# EAGLE design motor_controller_2_1 (EAGLE 9.6.2)
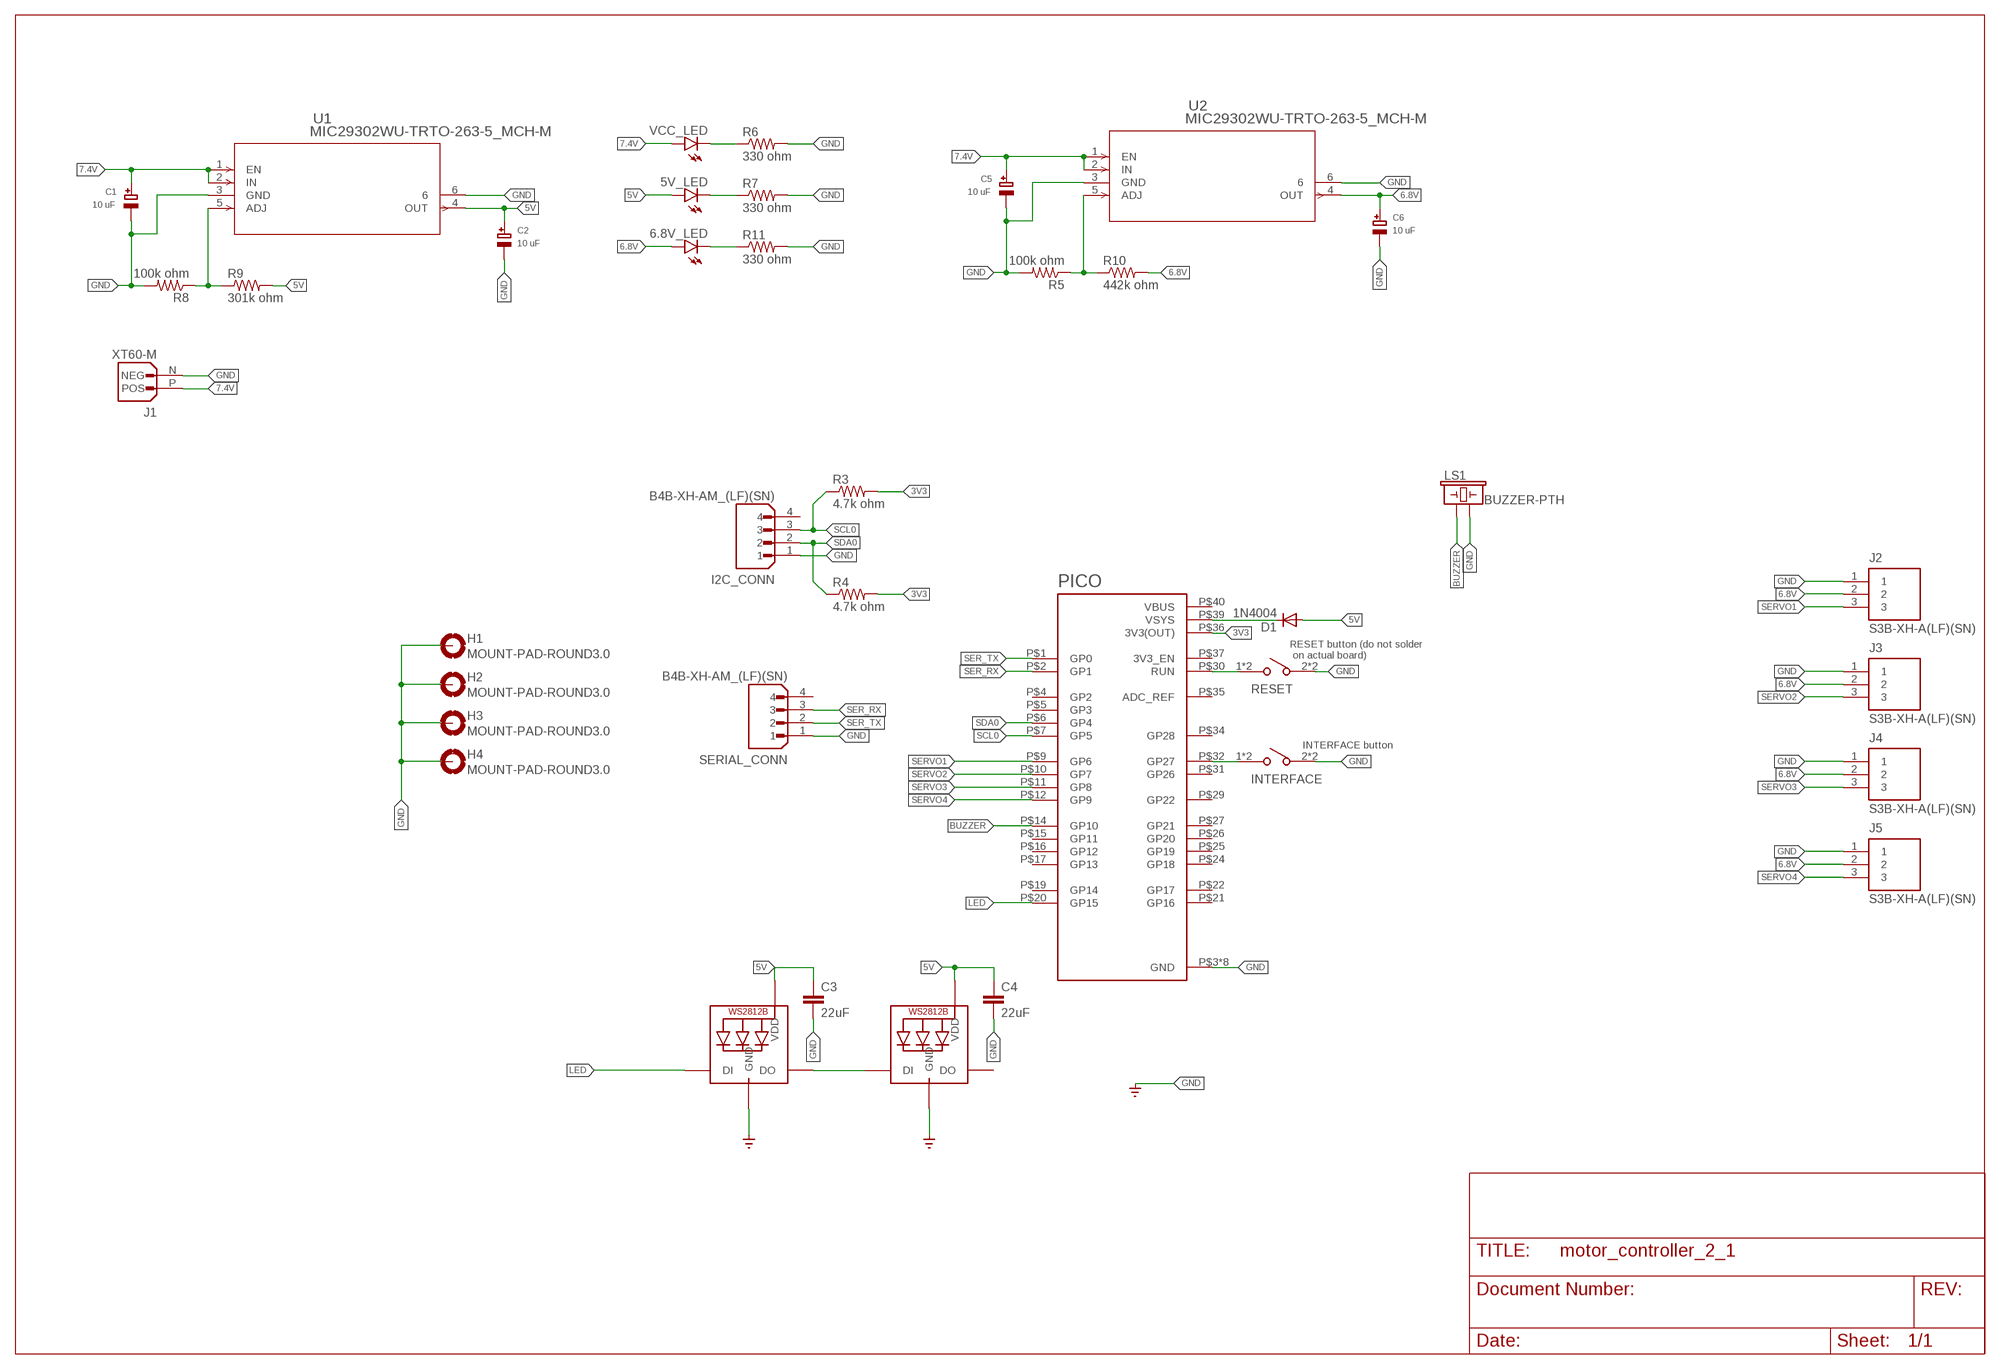
[diagram p0: schematic, sheet 1]

## Parts
5V_LED  LEDCHIPLED_1206  [CHIPLED_1206]
6.8V_LED  LEDCHIPLED_1206  [CHIPLED_1206]
C1  10 uF  CAP_TANTALUMA/3216_WAVE  [EIA3216-18/A-W]
C2  10 uF  CAP_TANTALUMA/3216_WAVE  [EIA3216-18/A-W]
C3  22uF  22UF-0805-16V-20%  [0805]
C4  22uF  22UF-0805-16V-20%  [0805]
C5  10 uF  CAP_TANTALUMA/3216_WAVE  [EIA3216-18/A-W]
C6  10 uF  CAP_TANTALUMA/3216_WAVE  [EIA3216-18/A-W]
D1  1N4004  [DO41-10]
H1  MOUNT-PAD-ROUND3.0  [3,0-PAD]
H2  MOUNT-PAD-ROUND3.0  [3,0-PAD]
H3  MOUNT-PAD-ROUND3.0  [3,0-PAD]
H4  MOUNT-PAD-ROUND3.0  [3,0-PAD]
I2C_CONN  B4B-XH-AM_(LF)(SN)  [JST_B4B-XH-AM_(LF)(SN)]
INTERFACE  TS04-66-95-BK-100-SMT  [SW_TS04-66-95-BK-100-SMT]
J1  XT60-M  [AMASS_XT60-M]
J2  S3B-XH-A(LF)(SN)  [JST_S3B-XH-A(LF)(SN)]
J3  S3B-XH-A(LF)(SN)  [JST_S3B-XH-A(LF)(SN)]
J4  S3B-XH-A(LF)(SN)  [JST_S3B-XH-A(LF)(SN)]
J5  S3B-XH-A(LF)(SN)  [JST_S3B-XH-A(LF)(SN)]
LED1  WS2812B3535  [LED3535]
LED2  WS2812B3535  [LED3535]
LS1  BUZZER-PTH  [BUZZER-12MM]
PICO  RASPBERRY_PICO-NO_DEBUG  [PICO-PKG-NO_DEBUG]
R3  4.7k ohm  R-US_R0805  [R0805]
R4  4.7k ohm  R-US_R0805  [R0805]
R5  100k ohm  R-US_R0805  [R0805]
R6  330 ohm  R-US_R0805  [R0805]
R7  330 ohm  R-US_R0805  [R0805]
R8  100k ohm  R-US_R0805  [R0805]
R9  301k ohm  R-US_R0805  [R0805]
R10  442k ohm  R-US_R0805  [R0805]
R11  330 ohm  R-US_R0805  [R0805]
RESET  TS04-66-95-BK-100-SMT  [SW_TS04-66-95-BK-100-SMT]
SERIAL_CONN  B4B-XH-AM_(LF)(SN)  [JST_B4B-XH-AM_(LF)(SN)]
U1  MIC29302WU-TRTO-263-5_MCH-M  [TO-263-5_MCH-M]
U2  MIC29302WU-TRTO-263-5_MCH-M  [TO-263-5_MCH-M]
VCC_LED  LEDCHIPLED_1206  [CHIPLED_1206]

## Nets
3V3: PICO.P$36(3V3(OUT)) R3.2 R4.2
5V: 5V_LED.A C2.+ C3.1 C4.1 D1.A LED1.2(VDD) LED2.2(VDD) R9.2 U1.4(OUT)
6.8V: 6.8V_LED.A C6.+ J2.2 J3.2 J4.2 J5.2 R10.2 U2.4(OUT)
7.4V: C1.+ C5.+ J1.P(POS) U1.1(EN) U1.2(IN) U2.1(EN) U2.2(IN) VCC_LED.A
BUZZER: LS1.+ PICO.P$14(GP10)
GND: C1.- C2.- C3.2 C4.2 C5.- C6.- H1.B3,0(MOUNT) H2.B3,0(MOUNT) H3.B3,0(MOUNT) H4.B3,0(MOUNT) I2C_CONN.1 INTERFACE.2 INTERFACE.4 J1.N(NEG) J2.1 J3.1 J4.1 J5.1 LED1.4(GND) LED2.4(GND) LS1.- PICO.P$3(GND) PICO.P$8(GND) PICO.P$13(GND) PICO.P$18(GND) PICO.P$23(GND) PICO.P$28(GND) PICO.P$33(GND) PICO.P$38(GND) R5.2 R6.2 R7.2 R8.2 R11.2 RESET.2 RESET.4 SERIAL_CONN.1 U1.3(GND) U1.6 U2.3(GND) U2.6 ; supply symbol labelled SUPPLY0_GND_
LED: LED1.1(DI) PICO.P$20(GP15)
N$1: D1.C PICO.P$39(VSYS)
N$2: PICO.P$30(RUN) RESET.1 RESET.3
N$3: INTERFACE.1 INTERFACE.3 PICO.P$32(GP27)
N$5: R5.1 R10.1 U2.5(ADJ)
N$7: LED1.3(DO) LED2.1(DI)
N$8: 6.8V_LED.C R11.1
N$9: R6.1 VCC_LED.C
N$10: 5V_LED.C R7.1
N$14: R8.1 R9.1 U1.5(ADJ)
SCL0: I2C_CONN.3 PICO.P$7(GP5) R3.1
SDA0: I2C_CONN.2 PICO.P$6(GP4) R4.1
SER_RX: PICO.P$2(GP1) SERIAL_CONN.3
SER_TX: PICO.P$1(GP0) SERIAL_CONN.2
SERVO1: J2.3 PICO.P$9(GP6)
SERVO2: J3.3 PICO.P$10(GP7)
SERVO3: J4.3 PICO.P$11(GP8)
SERVO4: J5.3 PICO.P$12(GP9)
Unconnected: I2C_CONN.4 LED2.3(DO) PICO.P$4(GP2) PICO.P$5(GP3) PICO.P$15(GP11) PICO.P$16(GP12) PICO.P$17(GP13) PICO.P$19(GP14) PICO.P$21(GP16) PICO.P$22(GP17) PICO.P$24(GP18) PICO.P$25(GP19) PICO.P$26(GP20) PICO.P$27(GP21) PICO.P$29(GP22) PICO.P$31(GP26) PICO.P$34(GP28) PICO.P$35(ADC_REF) PICO.P$37(3V3_EN) SERIAL_CONN.4

## Notes on the sheet
- RESET button (do not solder
   on actual board)
- INTERFACE button

## Power pins joined to a net without a drawn wire
VBUS: PICO.P$40(VBUS)

## Library data of the parts
5V_LED 6.8V_LED VCC_LED = led:LED: LED OSRAM: - CHIPLED LG R971, LG N971, LY N971, LG Q971, LY Q971, LO R971, LY R971 LH N974, LH R974 LS Q976, LO Q976, LY Q976 LO Q996 - Hyper CHIPLED LW Q18S LB Q993, LB Q99A, LB R99A - SideLED LS A670, LO A670, LY A670, LG A670, LP A670 LB A673, LV A673, LT A673, LW A673 LH A674 LY A675 LS A676, LA A676, LO A676, LY A676, LW A676 LS A679, LY A679, LG A679 - Hyper Micro SIDELED® LS Y876, LA Y876, LO Y876, LY Y876 LT Y87S - SmartLED LW L88C, LW L88S LB L89C, LB L89S, LG L890 LS L89K, LO L89K, LY L89K LS L896, LA L896, LO L896, LY L896 - TOPLED LS T670, LO T670, LY T670, LG T670, LP T670 LSG T670, LSP T670, LSY T670, LOP T670, LYG T670 LG T671, LOG T671, LSG T671 LB T673, LV T673, LT T673, LW T673 LH T674 LS T676, LA T676, LO T676, LY T676, LB T676, LH T676, LSB T676, LW T676 LB T67C, LV T67C, LT T67C, LS T67K, LO T67K, LY T67K, LW E67C LS E67B, LA E67B, LO E67B, LY E67B, LB E67C, LV E67C, LT E67C LW T67C LS T679, LY T679, LG T679 LS T770, LO T770, LY T770, LG T770, LP T770 LB T773, LV T773, LT T773, LW T773 LH T774 LS E675, LA E675, LY E675, LS T675 LS T776, LA T776, LO T776, LY T776, LB T776 LHGB T686 LT T68C, LB T68C - Hyper Mini TOPLED® LB M676 - Mini TOPLED Santana® LG M470 LS M47K, LO M47K, LY M47K Source: http://www.osram.convergy.de LUXEON: - LUMILED® LXK2-PW12-R00, LXK2-PW12-S00, LXK2-PW14-U00, LXK2-PW14-V00 LXK2-PM12-R00, LXK2-PM12-S00, LXK2-PM14-U00 LXK2-PE12-Q00, LXK2-PE12-R00, LXK2-PE12-S00, LXK2-PE14-T00, LXK2-PE14-U00 LXK2-PB12-K00, LXK2-PB12-L00, LXK2-PB12-M00, LXK2-PB14-N00, LXK2-PB14-P00, LXK2-PB14-Q00 LXK2-PR12-L00, LXK2-PR12-M00, LXK2-PR14-Q00, LXK2-PR14-R00 LXK2-PD12-Q00, LXK2-PD12-R00, LXK2-PD12-S00 LXK2-PH12-R00, LXK2-PH12-S00 LXK2-PL12-P00, LXK2-PL12-Q00, LXK2-PL12-R00 Source: www.luxeon.com KINGBRIGHT: KA-3528ASYC Source: www.kingbright.com
C1 C2 C5 C6 = microbuilder:CAP_TANTALUM: Tantalum Capacitors Wave footprints have larger pads and are meant to be used for hand soldering. Reflow footprints are optimised for solder paste and a reflow oven. EIA3216-18/A-[R/W] - Size A / 3216-18 / 1206 footprint 4.7µF 25V 10% Tantalum Capacitor 10µF 16V 10% Tantalum Capacitor [Digikey: 495-2236-2-ND] EIA3528-21/B-[R/W] - Size B / 3528-21 47µF 10V 10% Tantalum Capactior [Digikey: 495-2216-1-ND] EIA6032-28/C-[R/W] - Size C / 6032-28 10µF 35V 20% Tantalum Capacitor [Digikey: 495-2285-1-ND] 100µF 16V 10% Tantalum Capactior [Digikey: 399-5214-1-ND]
C3 C4 = SparkFun-Capacitors:22UF: 22µF ceramic capacitors A capacitor is a passive two-terminal electrical component used to store electrical energy temporarily in an electric field.; PROD_ID: CAP-14260
D1 = adafruit:1N4004: DIODE General purpose 1N400x type rectifier (With bigger pads) http://www.ladyada.net/library/pcb/eaglelibrary.html
H1-H4 = holes:MOUNT-PAD-ROUND: MOUNTING PAD, round
I2C_CONN SERIAL_CONN = B4B-XH-AM__LF__SN_:B4B-XH-AM_(LF)(SN): Check availability <https://pricing.snapeda.com/parts/B4B-XH-AM%20%28LF%29%28SN%29/JST%20Corporation/view-part?ref=eda>; AVAILABILITY: In Stock; CHECK_PRICES: https://www.snapeda.com/parts/B4B-XH-AM%20(LF)(SN)/JST/view-part/?ref=eda; DESCRIPTION: Conn Shrouded Header HDR 4 POS 2.5mm Solder ST Top Entry Thru-Hole Box; MF: JST Corporation; MP: B4B-XH-AM (LF)(SN); PACKAGE: None; PRICE: None; SNAPEDA_LINK: https://www.snapeda.com/parts/B4B-XH-AM%20(LF)(SN)/JST/view-part/?ref=snap
INTERFACE RESET = TS04-66-95-BK-100-SMT:TS04-66-95-BK-100-SMT: Check availability <https://pricing.snapeda.com/parts/TS04-66-95-BK-100-SMT/CUI%20Devices/view-part?ref=eda>; AVAILABILITY: In Stock; CHECK_PRICES: https://www.snapeda.com/parts/TS04-66-95-BK-100-SMT/CUI+Devices/view-part/?ref=eda; CUI_PURCHASE_URL: https://www.cuidevices.com/product/switches/tactile-switches/ts04-66-95-bk-100-smt?utm_source=snapeda.com&utm_medium=referral&utm_campaign=snapedaBOM; DESCRIPTION: 6 x 6 mm, 9.5 mm Actuator Height, 100 gf, Black, Surface Mount, SPST, Tactile Switch; MF: CUI Devices; MP: TS04-66-95-BK-100-SMT; PACKAGE: None; PRICE: None; SNAPEDA_LINK: https://www.snapeda.com/parts/TS04-66-95-BK-100-SMT/CUI+Devices/view-part/?ref=snap
J1 = XT60-M:XT60-M: Check availability <https://pricing.snapeda.com/parts/XT60-M/AMASS/view-part?ref=eda>; AVAILABILITY: Not in stock; DESCRIPTION: Plug; DC supply; XT60; male; PIN: 2; for cable; soldered; 30A; 500V; MF: AMASS; MP: XT60-M; PACKAGE: Package; PRICE: None
J2-J5 = S3B-XH-A_LF__SN_:S3B-XH-A(LF)(SN): Connector Header Through Hole, Right Angle 3 position 0.098" (2.50mm) Check availability <https://pricing.snapeda.com/parts/S3B-XH-A%28LF%29%28SN%29/JST%20Sales/view-part?ref=eda>; AVAILABILITY: In Stock; CHECK_PRICES: https://www.snapeda.com/parts/S3B-XH-A(LF)(SN)/JST+Sales+America+Inc./view-part/?ref=eda; DESCRIPTION: Connector Header Through Hole, Right Angle 3 position 0.098 (2.50mm); MF: JST Sales; MP: S3B-XH-A(LF)(SN); PACKAGE: Custom Package JST Sales; PRICE: None; SNAPEDA_LINK: https://www.snapeda.com/parts/S3B-XH-A(LF)(SN)/JST+Sales+America+Inc./view-part/?ref=snap
LED1 LED2 = WS2812B:WS2812B: Check availability <https://pricing.snapeda.com/parts/WS2812B/Worldsemi/view-part?ref=eda>; AVAILABILITY: Not in stock; CHECK_PRICES: https://www.snapeda.com/parts/WS2812B/Worldsemi/view-part/?ref=eda; DESCRIPTION: Intelligent control LED integrated light source; MF: Worldsemi; MP: WS2812B; PACKAGE: None; PRICE: None; SNAPEDA_LINK: https://www.snapeda.com/parts/WS2812B/Worldsemi/view-part/?ref=snap
LS1 = SparkFun-Electromechanical:BUZZER: Buzzer Small round buzzers that operate around the audible 2kHz range. You can use these as speakers to create simple music or user interfaces. Variant Overview: PTH - Mini Speaker - PC Mount 12mm 2.048kHz <https://www.sparkfun.com/products/7950> PTH_KIT - Mini Speaker - PC Mount 12mm 2.048kHz <https://www.sparkfun.com/products/7950> KIT simplifies soldering by adding stop mask to one side of the pads. PTH_NO_SILK - Mini Speaker - PC Mount 12mm 2.048kHz <https://www.sparkfun.com/products/7950> No silkscreen indicator of buzzer outline. PTH_KIT_NO_SILK - Mini Speaker - PC Mount 12mm 2.048kHz <https://www.sparkfun.com/products/7950> KIT package w/o silkscreen SMD - Buzzer Audio Magnetic (CCV-084B16) SMD buzzer used on, e.g. the LilyPad Buzzer <https://www.sparkfun.com/products/8463> and RFID USB Reader <https://www.sparkfun.com/products/9963>. SMD_KIT - Buzzer Audio Magnetic (CCV-084B16) SMD Buzzer with elongated pins to make soldering easier. Used on the SparkFun Simon Says - Surface Mount Soldering Kit <https://www.sparkfun.com/products/10935>. SMD-SQUARE - Buzzer Audio Magnetic (COMP-15701) SMT square buzzer with one chamfered corner.; PROD_ID: COMP-08253; SF_SKU: COM-07950
PICO = RpiPico:RASPBERRY_PICO-NO_DEBUG
R3-R11 = rcl:R-US_: RESISTOR, American symbol; SPICEPREFIX: R
U1 U2 = MIC29302WU:MIC29302WU-TR; COPYRIGHT: Copyright (C) 2024 Ultra Librarian. All rights reserved.; MANUFACTURER_PART_NUMBER: MIC29302WU-TR; MFR_NAME: Microchip

## Board
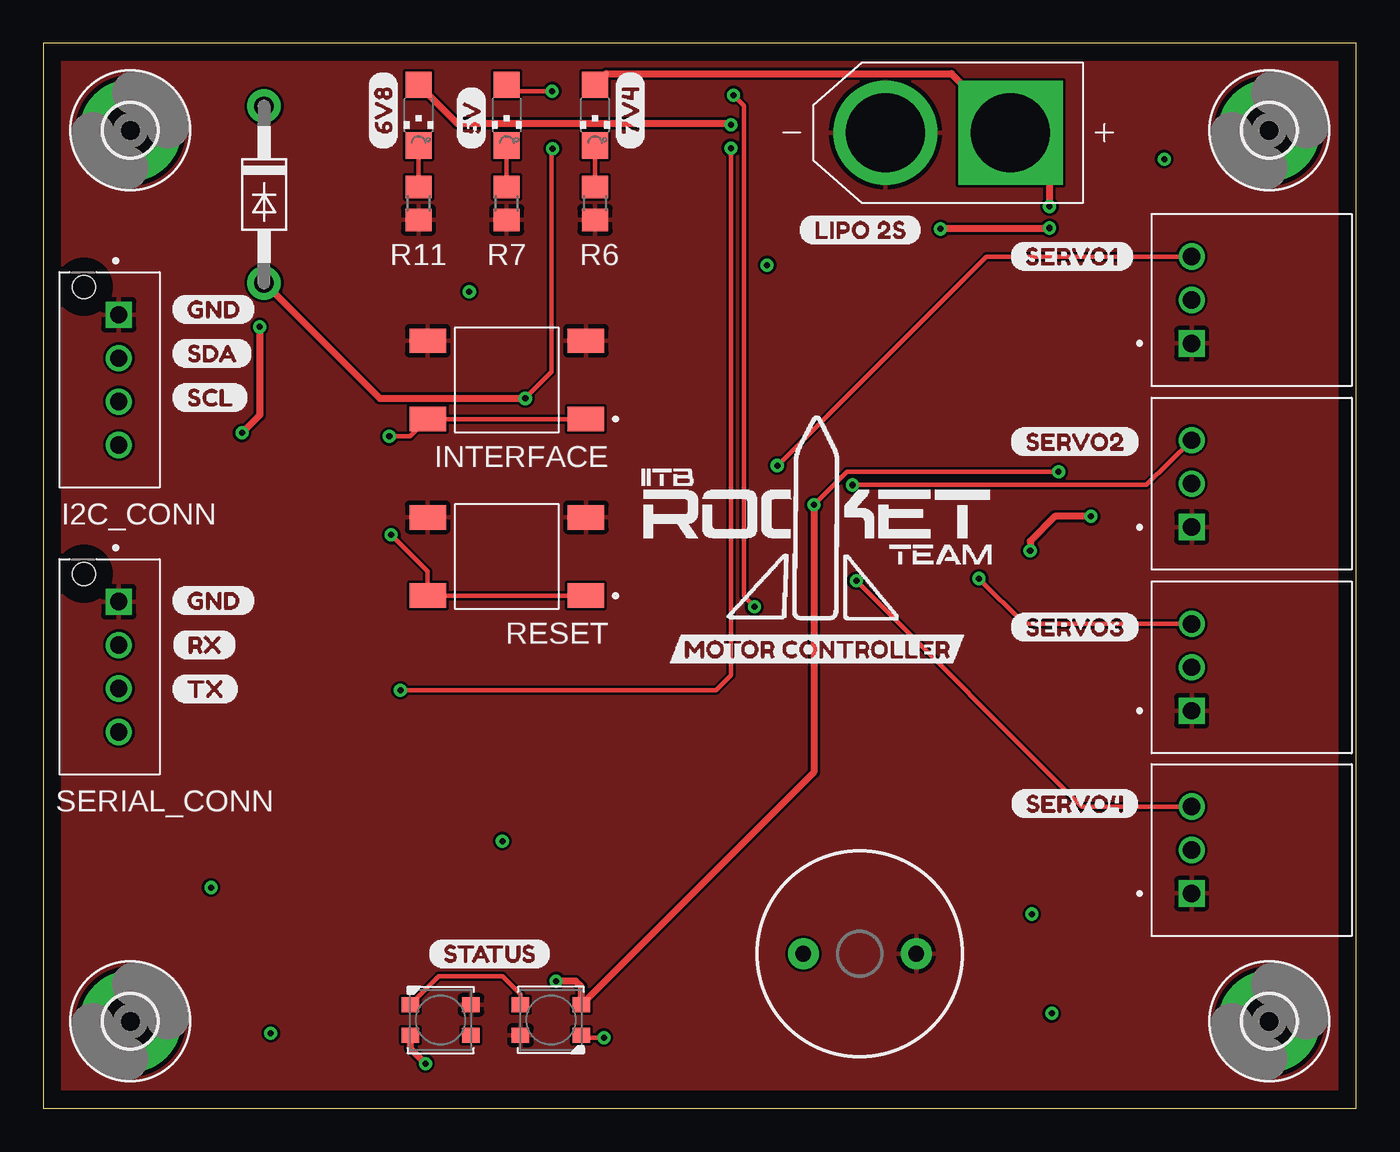
[diagram p1: board, top side]
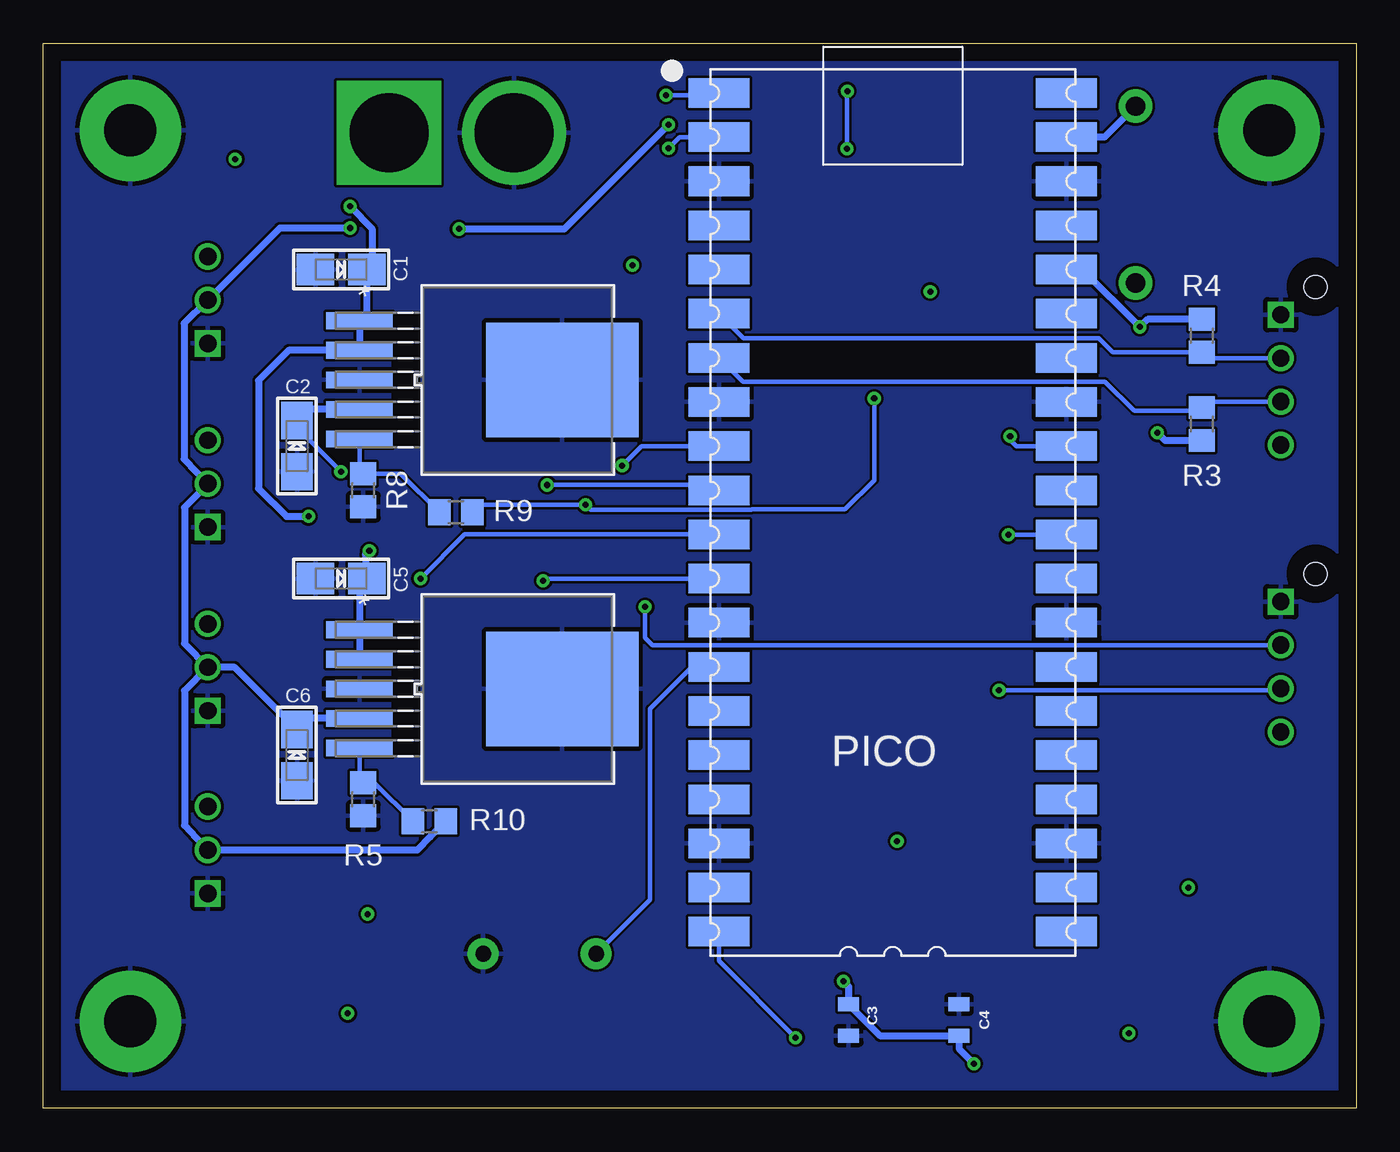
[diagram p2: board, bottom side, seen from below]

Size 75.56 x 61.27 mm. Coordinates in mm from the lower left corner, seen from the top.
Outline: 0,0 75.56,0 75.56,61.27 0,61.27 0,0
Copper layers (1*16): Top 0.035mm / dielectric 1.5mm / Bottom 0.035mm
Design rules "default": minimum track width 6mil, minimum drill 0.35mm, track to track 6mil, track to pad 6mil, pad to pad 6mil, via to via 6mil, smd to smd 6mil, copper to edge 40mil, drill to drill 6mil, minimum pad ring 10mil, minimum via ring 8mil, stop-mask expansion 4mil, vias tented up to drill 0mil, thermal gap 10mil

### Footprints (pad centres in the part's own frame; a part is rotated, then mirrored left to right if it is on the bottom)
CHIPLED_1206 = smd 1.5 x 1.5: A 0,-1.75; C 0,1.75
EIA3216-18/A-W = smd 2.15 x 1.8: + 1.475,0; - -1.475,0
0805 = smd 0.8 x 1.2: 1 -0.9,0; 2 0.9,0
DO41-10 = drill 1.118 pad 1.93: A 5.08,0; C -5.08,0
3,0-PAD = drill 3 pad 5.842: B3,0 0,0
JST_B4B-XH-AM_(LF)(SN) = drill 1 square: 1 3.75,-0.525 | drill 1: 2 1.25,-0.525; 3 -1.25,-0.525; 4 -3.75,-0.525 | hole 1.3: 5.35,1.475
SW_TS04-66-95-BK-100-SMT = smd 2.1 x 1.4: 1 -4.55,2.25; 2 -4.55,-2.25; 3 4.55,2.25; 4 4.55,-2.25
AMASS_XT60-M = drill 4.55 pad 6: N 3.6,0 | drill 4.55 pad 6 square: P -3.6,0
JST_S3B-XH-A(LF)(SN) = drill 1 square: 1 2.5,-3.45 | drill 1: 2 0,-3.45; 3 -2.5,-3.45
LED3535 = smd 1 x 0.85: 1 -1.75,0.875; 2 -1.75,-0.875; 3 1.75,-0.875; 4 1.75,0.875
BUZZER-12MM = drill 0.9 pad 1.778: + 3.25,0; - -3.25,0
PICO-PKG-NO_DEBUG = smd 3.5 x 1.7: P$1 -8.73,25.4; P$2 -8.73,22.86; P$3 -8.73,20.32; P$4 -8.73,17.78; P$5 -8.73,15.24; P$6 -8.73,12.7; P$7 -8.73,10.16; P$8 -8.73,7.62; P$9 -8.73,5.08; P$10 -8.73,2.54; P$11 -8.73,0; P$12 -8.73,-2.54; P$13 -8.73,-5.08; P$14 -8.73,-7.62; P$15 -8.73,-10.16; P$16 -8.73,-12.7; P$17 -8.73,-15.24; P$18 -8.73,-17.78; P$19 -8.73,-20.32; P$20 -8.73,-22.86; P$21 11.27,-22.86; P$22 11.27,-20.32; P$23 11.27,-17.78; P$24 11.27,-15.24; P$25 11.27,-12.7; P$26 11.27,-10.16; P$27 11.27,-7.62; P$28 11.27,-5.08; P$29 11.27,-2.54; P$30 11.27,0; P$31 11.27,2.54; P$32 11.27,5.08; P$33 11.27,7.62; P$34 11.27,10.16; P$35 11.27,12.7; P$36 11.27,15.24; P$37 11.27,17.78; P$38 11.27,20.32; P$39 11.27,22.86; P$40 11.27,25.4
R0805 = smd 1.3 x 1.5: 1 -0.95,0; 2 0.95,0
TO-263-5_MCH-M = smd 0.965 x 3.81: 1 -3.404,-9.106; 2 -1.702,-9.106; 3 0,-9.106; 4 1.702,-9.106; 5 3.404,-9.106 | smd 6.604 x 8.763: 6 0,2.565

### Placement (x,y rotation side)
5V_LED  26.67,57.15 180 top
6.8V_LED  21.59,57.15 180 top
C1  58.42,48.26 0 bottom
C2  60.96,38.1 90 bottom
C3  29.21,5.08 270 bottom
C4  22.86,5.08 90 bottom
C5  58.42,30.48 0 bottom
C6  60.96,20.32 90 bottom
D1  12.7,52.58 270 top
H1  70.56,56.27 0 top
H2  5,56.27 0 top
H3  5,5 0 top
H4  70.56,5 0 top
I2C_CONN  3.81,41.91 90 top
INTERFACE  26.67,41.91 180 top
J1  52.07,56.13 180 top
J2  69.55,46.51 270 top
J3  69.55,35.94 270 top
J4  69.55,25.37 270 top
J5  69.55,14.86 270 top
LED1  29.21,5.08 180 top
LED2  22.86,5.08 0 top
LS1  46.99,8.89 180 top
PICO  27.94,33.02 0 bottom
R3  8.89,39.37 270 bottom
R4  8.89,44.45 90 bottom
R5  57.15,17.78 270 bottom
R6  31.75,52.07 270 top
R7  26.67,52.07 270 top
R8  57.15,35.56 270 bottom
R9  51.82,34.29 0 bottom
R10  53.34,16.51 0 bottom
R11  21.59,52.07 270 top
RESET  26.67,31.75 180 top
SERIAL_CONN  3.81,25.4 90 top
U1  48.26,41.91 270 bottom
U2  48.26,24.13 270 bottom
U$1  [SERVO10]  55.63,49.02 0 top
U$2  [SERVO20]  55.63,38.35 0 top
U$3  [SERVO30]  55.63,27.69 0 top
U$4  [SERVO40]  55.63,17.53 0 top
U$5  [SDA0]  7.37,43.43 0 top
U$6  [SCL0]  7.37,40.89 0 top
U$7  [GND0]  7.37,45.97 0 top
U$8  [GND0]  7.37,29.21 0 top
U$9  [RX0]  7.37,26.67 0 top
U$10  [TX0]  7.37,24.13 0 top
U$11  [LIPO_2S0]  43.43,50.55 0 top
U$12  [5V0]  24.64,55.12 90 top
U$13  [7V40]  33.78,55.12 90 top
U$14  [6V80]  19.56,55.12 90 top
U$15  [STATUS0]  22.1,8.89 0 top
U$16  [MOTOR_CONTROLLER0]  35.94,26.42 0 top
VCC_LED  31.75,57.15 180 top

### Tracks (layer width: path | path; a pad name or v marks a point on that pad's centre or on a via)
3V3  (via drill 0.35)
  Top 0.406: v12.45,44.96 12.45,39.88 v11.43,38.86
  Bottom 0.406: R4.2 12,45.4 v12.45,44.96 15.75,48.26 PICO.P$36 | R3.2 10.99,38.42 v11.43,38.86
5V  (via drill 0.35)
  Top 0.254: v58.43,36.63 46.25,36.63 v44.35,34.72 | v27.74,40.84 29.26,42.37 29.26,55.17 v29.31,55.22 | v29.29,58.52 27.05,58.52 5V_LED.A
  Top 0.406: v29.52,7.31 30.63,7.31 30.96,6.99 LED1.2 44.35,19.34 v44.35,34.72 | LED2.2 21.11,3.45 v22,2.57 | D1.A 19.36,40.84 v27.74,40.84
  Bottom 0.254: C2.+ 60.96,39.16 v58.43,36.63 | R9.2 50.43,34.72 v44.35,34.72 44.06,34.43 34.8,34.43 34.77,34.47 29.41,34.47 27.74,36.14 v27.74,40.84 | v29.31,55.22 29.31,58.5 v29.29,58.52
  Bottom 0.406: U1.4 60.33,40.21 C2.+ | v22,2.57 22.86,3.43 C4.1 27.41,4.18 C3.1 29.21,7.01 v29.52,7.31
6.8V  (via drill 0.35)
  Top 0.406: v57.91,50.65 57.91,50.6 v51.64,50.6 | 6.8V_LED.A 23.82,56.67 39.5,56.67 v39.57,56.59
  Bottom 0.406: U2.4 60.33,22.43 C6.+ 64.54,25.38 J4.2 | v39.57,56.59 45.57,50.6 v51.64,50.6 | v57.91,50.65 61.95,50.65 J2.2 66.11,46.51 67.46,45.16 67.46,37.35 J3.2 66.06,35.94 67.43,34.57 67.43,26.74 J4.2 | J4.2 67.43,24.03 67.43,16.27 J5.2 54.04,14.86 53.28,15.61 53.28,15.62 R10.2
7.4V  (via drill 0.35)
  Top 0.406: VCC_LED.A 32.39,59.54 52.27,59.54 J1.P 57.91,53.89 v57.91,51.89 | v60.3,34.06 58.22,34.06 56.79,32.64 v56.79,32.08
  Bottom 0.406: C5.+ 57.02,30.4 | 57.02,30.4 57.37,30.06 U2.1 U2.2 | v57.91,51.89 56.64,50.62 56.64,48.56 C1.+ 56.95,45.73 U1.1 U1.2 61.44,43.61 63.17,41.88 63.17,35.66 61.57,34.06 v60.3,34.06 | v56.79,32.08 57.02,31.85 57.02,30.4
BUZZER
  Bottom 0.254: LS1.+ 40.64,11.99 40.64,22.99 38.23,25.4 PICO.P$14
GND
  pour Bottom: -0.08,61.21 -0.08,-0.08 75.44,-0.08 75.44,61.21
  pour Top: -0.2,61.29 -0.2,-0.05 75.46,-0.05 75.46,61.29
LED  (via drill 0.35)
  Top 0.254: v32.26,4.06 31.1,4.06 LED1.1
  Bottom 0.254: PICO.P$20 36.67,8.48 v32.26,4.06
N$1
  Bottom 0.406: D1.C 14.48,55.88 PICO.P$39
N$2  (via drill 0.35)
  Top 0.254: RESET.1 RESET.3 22.12,30.89 v20.02,32.99
  Bottom 0.254: v20.02,32.99 16.7,32.99 PICO.P$30
N$3  (via drill 0.35)
  Top 0.254: v19.91,38.66 21.12,38.66 INTERFACE.3 INTERFACE.1
  Bottom 0.254: PICO.P$32 19.56,38.1 19.91,38.46 v19.91,38.66
N$4  (via drill 0.35)
  other vias: 9.65,12.7
N$5
  Bottom 0.254: R10.1 56.51,18.73 R5.1 57.37,18.95 U2.5
N$6  (via drill 0.35)
  other vias: 26.42,15.37
N$7
  Top 0.254: LED2.1 22.75,7.59 26.42,7.59 27.46,6.55 LED1.3
N$8
  Top 0.254: 6.8V_LED.C R11.1
N$9
  Top 0.254: VCC_LED.C R6.1
N$10
  Top 0.254: 5V_LED.C R7.1
N$11  (via drill 0.35)
  other vias: 58.04,5.46
N$12  (via drill 0.35)
  other vias: 56.9,11.18
N$13  (via drill 0.35)
  other vias: 41.66,48.51
N$14
  Bottom 0.254: R9.1 54.99,36.51 57.02,36.51 | 57.02,36.51 R8.1 | U1.5 57.37,36.85 57.02,36.51
N$15  (via drill 0.35)
  other vias: 64.52,54.61
N$16  (via drill 0.35)
  other vias: 24.51,46.99
N$17  (via drill 0.35)
  other vias: 13.08,4.32
SCL0
  Bottom 0.254: I2C_CONN.3 8.55,40.66 R3.1 9.08,40.13 12.78,40.13 14.45,41.81 35.3,41.81 PICO.P$7
SDA0
  Bottom 0.254: I2C_CONN.2 8.55,43.16 R4.1 13.99,43.5 14.8,44.31 35.26,44.31 PICO.P$6
SER_RX  (via drill 0.35)
  Top 0.254: v39.57,55.24 39.57,24.92 38.71,24.05 v20.55,24.05
  Bottom 0.254: PICO.P$2 38.94,55.88 v39.57,55.24 | v20.55,24.05 4.43,24.05 SERIAL_CONN.3
SER_TX  (via drill 0.35)
  Top 0.254: v40.92,28.85 40.31,29.46 40.31,39.8 40.34,39.82 40.34,57.68 v39.73,58.29
  Bottom 0.254: SERIAL_CONN.2 40.49,26.65 40.92,27.08 v40.92,28.85 | v39.73,58.29 36.8,58.29 PICO.P$1
SERVO1  (via drill 0.35)
  Top 0.254: J2.3 54.27,49.01 v42.24,36.98
  Bottom 0.254: PICO.P$9 41.12,38.1 v42.24,36.98
SERVO2  (via drill 0.35)
  Top 0.254: J3.3 63.47,35.87 v46.56,35.87
  Bottom 0.254: PICO.P$10 37.11,35.56 37.41,35.87 v46.56,35.87
SERVO3  (via drill 0.35)
  Top 0.254: v53.85,30.48 56.45,27.88 J4.3
  Bottom 0.254: PICO.P$11 51.31,33.02 v53.85,30.48
SERVO4  (via drill 0.35)
  Top 0.254: v46.79,30.35 59.78,17.36 J5.3
  Bottom 0.254: PICO.P$12 46.66,30.48 v46.79,30.35

### Text on the board
bNames: R10